# EAGLE design freebus-sniffer (EAGLE 4.16)
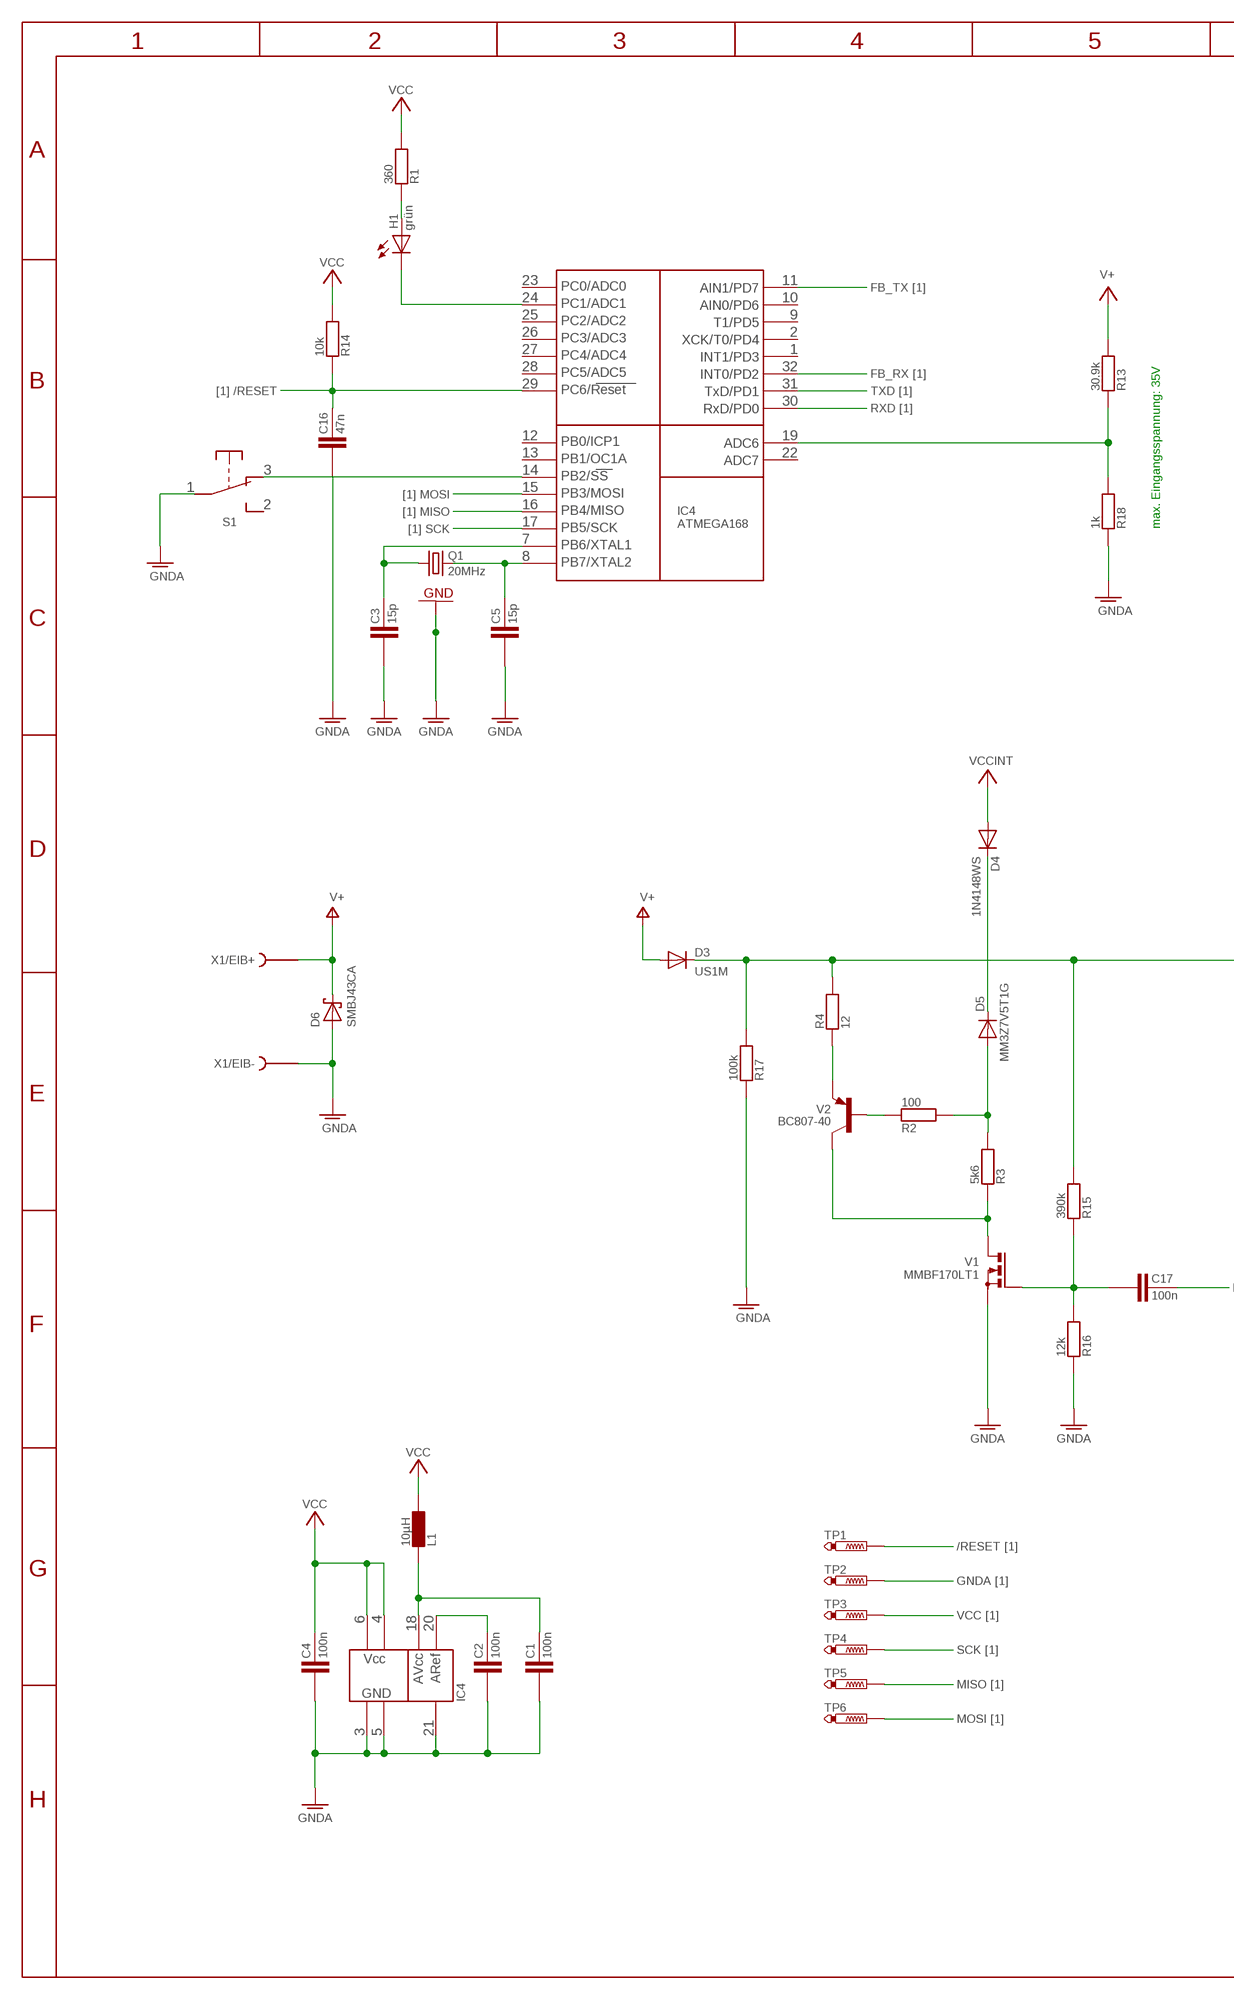
[diagram p0: schematic, sheet 1, part 1 of 2]
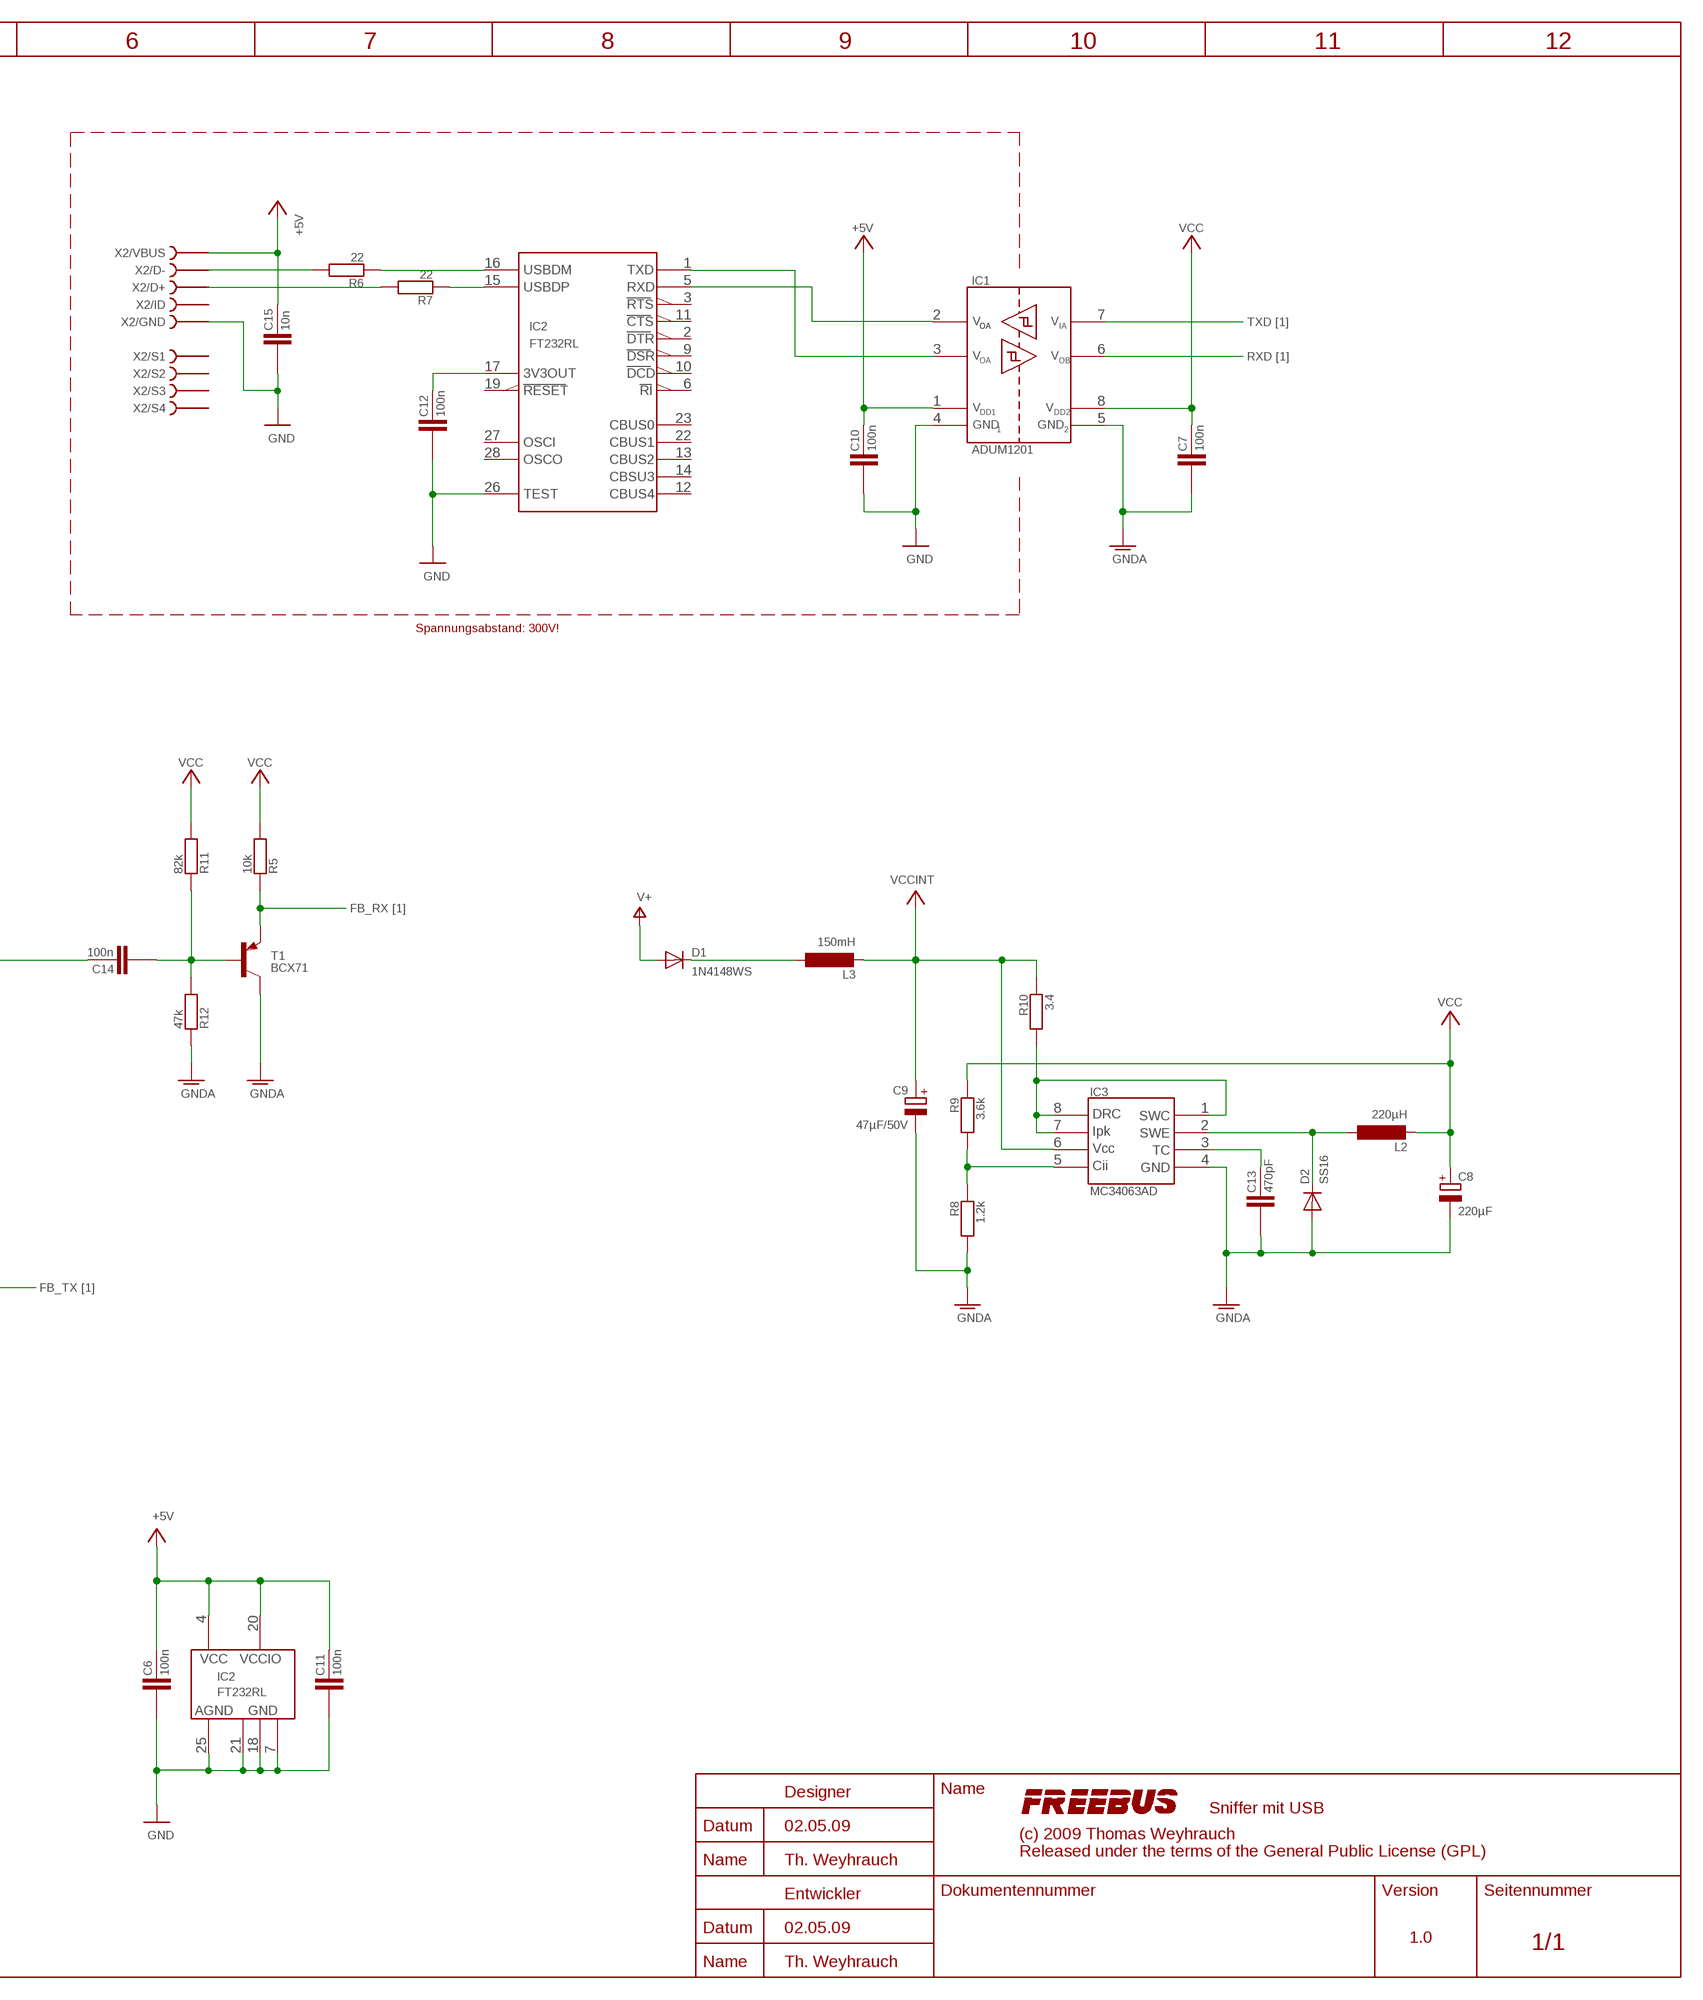
[diagram p1: schematic, sheet 1, part 2 of 2]

## Parts
C1  100n  C-0805  [0805]
C2  100n  C-0805  [0805]
C3  15p  C-0805  [0805]
C4  100n  C-0805  [0805]
C5  15p  C-0805  [0805]
C6  100n  C-0805  [0805]
C7  100n  C-0805  [0805]
C8  220µF  CPOL-EUE5-8.5  [E5-8,5]
C9  47µF/50V  CPOL-EUE5-6  [E5-6]
C10  100n  C-0805  [0805]
C11  100n  C-0805  [0805]
C12  100n  C-0805  [0805]
C13  470pF  C-0805  [0805]
C14  100n  C-0805  [0805]
C15  10n  C-0805  [0805]
C16  47n  C-0805  [0805]
C17  100n  C-0805  [0805]
D1  1N4148WS  DIODE-SOD323-R  [SOD323-R]
D2  SS16  DIODE-DO214AC  [DO214AC]
D3  US1M  DIODE-DO214AC  [DO214AC]
D4  1N4148WS  DIODE-SOD323-R  [SOD323-R]
D5  MM3Z7V5T1G  DIODE-SOD323-R  [SOD323-R]
D6  SMBJ43CA  SCHOTTKY-DIODESMD  [SMB]
H1  grün  LED3MM  [LED3MM]
IC1  ADUM1201  [SO8]
IC2  FT232RL  [SSOP28]
IC3  MC34063AD  [SO8]
IC4  ATMEGA168  ATMEGA8/48/88/168-AU  [TQFP32]
L1  10µH  L-0805  [0805]
L2  220µH  L-EU0207/2V  [0207/2V]
L3  150mH  L-EU0204/5  [0204/5]
Q1  20MHz  Q-NX3225SA  [Q_3.2X2.5]
R1  360  R-0805  [0805]
R2  100  R-0805  [0805]
R3  5k6  R-0805  [0805]
R4  12  R-EU_MELF0204W  [MINI_MELF-0204W]
R5  10k  R-0805  [0805]
R6  22  R-0805  [0805]
R7  22  R-0805  [0805]
R8  1.2k  R-0805  [0805]
R9  3.6k  R-0805  [0805]
R10  3.4  R-0805  [0805]
R11  82k  R-0805  [0805]
R12  47k  R-0805  [0805]
R13  30.9k  R-0805  [0805]
R14  10k  R-0805  [0805]
R15  390k  R-0805  [0805]
R16  12k  R-0805  [0805]
R17  100k  R-0805  [0805]
R18  1k  R-0805  [0805]
S1  SCHIEBESCHALTER_1XUM_90°  [SCHIEBESCHALTER-ABGEWINKELT]
T1  BCX71  BCX71SMD  [SOT23]
TP1  PTR1B1,27  [B1,27]
TP2  PTR1B1,27  [B1,27]
TP3  PTR1B1,27  [B1,27]
TP4  PTR1B1,27  [B1,27]
TP5  PTR1B1,27  [B1,27]
TP6  PTR1B1,27  [B1,27]
V1  MMBF170LT1  [SOT23]
V2  BC807-40  BC807-40SMD  [SOT23-BEC]
X1  EIB-BUSKLEMME  [EIB-BUSKLEMME]
X2  USB-MINI  [USB-M-S]

## Nets
3V3OUT: C12.1 IC2.17(A:3V3OUT)
+5V: C6.1 C10.1 C11.1 C15.1 IC1.1(VDD1) IC2.4(P:VCCIO) IC2.20(P:VCC) X2.VBUS
/RESET: C16.1 IC4.29(A:PC6) R14.1 TP1.PP(TP)
D+: R7.2 X2.D+
D-: R6.2 X2.D-
FB_RX: IC4.32(A:PD2) R5.1 T1.2(E)
FB_TX: C17.1 IC4.11(A:PD7)
GND: C6.2 C10.2 C11.2 C12.2 C15.2 IC1.4(GND1) IC2.7(P:GND) IC2.18(P:GND) IC2.21(P:GND) IC2.25(P:AGND) IC2.26(A:TEST) X2.GND
GNDA: C1.2 C2.2 C3.2 C4.2 C5.2 C7.2 C8.- C9.- C13.2 C16.2 D2.A D6.A IC1.5(GND2) IC3.4(GND) IC4.3(P:GND) IC4.5(P:GND) IC4.21(P:GND) Q1.2 Q1.4 R8.2 R12.1 R16.1 R17.1 R18.1 S1.1(P) T1.3(C) TP2.PP(TP) V1.2(S) X1.-
MISO: IC4.16(A:PB4) TP5.PP(TP)
MOSI: IC4.15(A:PB3) TP6.PP(TP)
N$1: C5.1 IC4.8(A:PB7) Q1.3
N$2: C3.1 IC4.7(A:PB6) Q1.1
N$3: IC1.3(VIB) IC2.1(A:TXD)
N$4: H1.A R1.1
N$5: H1.K(C) IC4.24(A:PC1)
N$8: IC2.16(A:USBDM) R6.1
N$9: IC2.15(A:USBDP) R7.1
N$10: IC4.14(A:PB2) S1.3(O)
N$11: D4.C D5.C
N$12: IC4.19(A:ADC6) R13.1 R18.2
N$13: C1.1 IC4.18(P:AVCC) L1.1
N$14: IC1.2(VOA) IC2.5(A:RXD)
N$15: C2.1 IC4.20(P:AREF)
N$17: D1.C L3.1
N$18: IC3.1(SWC) IC3.7(IPK) IC3.8(DRC) R10.2
N$19: C13.1 IC3.3(TC)
N$20: D2.C IC3.2(SWE) L2.1
N$21: IC3.5(CII) R8.1 R9.2
N$22: C14.2 R11.1 R12.2 T1.1(B)
N$24: R4.1 V2.E
N$25: R2.1 V2.B
N$26: D5.A R2.2 R3.2
N$27: R3.1 V1.3(D) V2.C
N$28: C14.1 D3.C R4.2 R15.2 R17.2
N$29: C17.2 R15.1 R16.2 V1.1(G)
RXD: IC1.6(VOB) IC4.30(A:PD0)
SCK: IC4.17(A:PB5) TP4.PP(TP)
TXD: IC1.7(VIA) IC4.31(A:PD1)
V+: D1.A D3.A D6.C R13.2 X1.+
VCC: C4.1 C7.1 C8.+ IC1.8(VDD2) IC4.4(P:VCC) IC4.6(P:VCC) L1.2 L2.2 R1.2 R5.2 R9.1 R11.2 R14.2 TP3.PP(TP)
VCCINT: C9.+ D4.A IC3.6(VCC) L3.2 R10.1
Unconnected: IC2.2(A:DTR) IC2.3(A:RTS) IC2.6(A:RI) IC2.8 IC2.9(A:DSR) IC2.10(A:DCD) IC2.11(A:CTS) IC2.12(A:CBUS4) IC2.13(A:CBUS2) IC2.14(A:CBUS3) IC2.19(A:RESET) IC2.22(A:CBUS1) IC2.23(A:CBUS0) IC2.24 IC2.27(A:OSCI) IC2.28(A:OSCO) IC4.1(A:PD3) IC4.2(A:PD4) IC4.9(A:PD5) IC4.10(A:PD6) IC4.12(A:PB0) IC4.13(A:PB1) IC4.22(A:ADC7) IC4.23(A:PC0) IC4.25(A:PC2) IC4.26(A:PC3) IC4.27(A:PC4) IC4.28(A:PC5) S1.2(S) X2.ID X2.SHIELD@1 X2.SHIELD@2 X2.SHIELD@3 X2.SHIELD@4

## Notes on the sheet
- FB_TX [1]
- TXD [1]
- RXD [1]
- FB_RX [1]
- [1] /RESET
- TXD [1]
- RXD [1]
- [1] MOSI
- [1] MISO
- [1] SCK
- max. Eingangsspannung: 35V
- Spannungsabstand: 300V!
- FB_RX [1]
- FB_TX [1]
- /RESET [1]
- GNDA [1]
- VCC [1]
- SCK [1]
- MISO [1]
- MOSI [1]
- Sniffer mit USB
- 02.05.09
- (c) 2009 Thomas Weyhrauch
- Released under the terms of the General Public License (GPL)
- Th. Weyhrauch
- 02.05.09
- 1.0
- Th. Weyhrauch

## Library data of the parts
C1-C7 C10-C17 = weyhrauch:C
C8 C9 = rcl:CPOL-EU: POLARIZED CAPACITOR, European symbol
D1-D5 = diode:DIODE-: DIODE
D6 = diode:SCHOTTKY-DIODE: Schottky Diode
H1 = led:LED: LED OSRAM: - CHIPLED LG R971, LG N971, LY N971, LG Q971, LY Q971, LO R971, LY R971 LH N974, LH R974 LS Q976, LO Q976, LY Q976 LO Q996 - Hyper CHIPLED LW Q18S LB Q993, LB Q99A, LB R99A - SideLED LS A670, LO A670, LY A670, LG A670, LP A670 LB A673, LV A673, LT A673, LW A673 LH A674 LY A675 LS A676, LA A676, LO A676, LY A676, LW A676 LS A679, LY A679, LG A679 - Hyper Micro SIDELED® LS Y876, LA Y876, LO Y876, LY Y876 LT Y87S - SmartLED LW L88C, LW L88S LB L89C, LB L89S, LG L890 LS L89K, LO L89K, LY L89K LS L896, LA L896, LO L896, LY L896 - TOPLED LS T670, LO T670, LY T670, LG T670, LP T670 LSG T670, LSP T670, LSY T670, LOP T670, LYG T670 LG T671, LOG T671, LSG T671 LB T673, LV T673, LT T673, LW T673 LH T674 LS T676, LA T676, LO T676, LY T676, LB T676, LH T676, LSB T676, LW T676 LB T67C, LV T67C, LT T67C, LS T67K, LO T67K, LY T67K, LW E67C LS E67B, LA E67B, LO E67B, LY E67B, LB E67C, LV E67C, LT E67C LW T67C LS T679, LY T679, LG T679 LS T770, LO T770, LY T770, LG T770, LP T770 LB T773, LV T773, LT T773, LW T773 LH T774 LS E675, LA E675, LY E675, LS T675 LS T776, LA T776, LO T776, LY T776, LB T776 LHGB T686 LT T68C, LB T68C - Hyper Mini TOPLED® LB M676 - Mini TOPLED Santana® LG M470 LS M47K, LO M47K, LY M47K Source: http://www.osram.convergy.de - LUMILED® LXK2-PW12-R00, LXK2-PW12-S00, LXK2-PW14-U00, LXK2-PW14-V00 LXK2-PM12-R00, LXK2-PM12-S00, LXK2-PM14-U00 LXK2-PE12-Q00, LXK2-PE12-R00, LXK2-PE12-S00, LXK2-PE14-T00, LXK2-PE14-U00 LXK2-PB12-K00, LXK2-PB12-L00, LXK2-PB12-M00, LXK2-PB14-N00, LXK2-PB14-P00, LXK2-PB14-Q00 LXK2-PR12-L00, LXK2-PR12-M00, LXK2-PR14-Q00, LXK2-PR14-R00 LXK2-PD12-Q00, LXK2-PD12-R00, LXK2-PD12-S00 LXK2-PH12-R00, LXK2-PH12-S00 LXK2-PL12-P00, LXK2-PL12-Q00, LXK2-PL12-R00 Source: www.luxeon.com
IC1 = weyhrauch:ADUM1201: Analog Devices Dual-Channel Digital Isolator 3V - 5V 0Mbps - 25Mbps
IC2 = weyhrauch:FT232RL
IC3 = weyhrauch:MC34063A: MC34063A ON Semiconductor (http://onsemi.com) 1.5 A, Step?Up/Down/ Inverting Switching Regulators
IC4 = weyhrauch:ATMEGA8/48/88/168-*: ATMEL ATMEGA8/48/88/168
L1 = weyhrauch:L
L2 L3 = rcl:L-EU: INDUCTOR, European symbol
Q1 = weyhrauch:Q-NX3225SA: SMD-Quarz NDK Crystal <http://www.ndk.com> Typ: NX3225SA Gehäuse: 3.2mm x 2.5mm Bezugsquelle: CSD-Electronics <http://www.csd-electronics.de>
R1-R3 R5-R18 = weyhrauch:R
R4 = rcl:R-EU_: RESISTOR, European symbol
S1 = weyhrauch:SCHIEBESCHALTER_1XUM_90°: Schiebeschalter, 90° abgewinkelt Hersteller: eao Serie: 1K2
T1 = transistor-pnp:BCX71SMD: PNP Transistor
TP1-TP6 = testpad:PTR1: TEST PIN
V1 = weyhrauch:MMBF170LT1: MMBF170LT1 ON Semiconductor SOT23; N-Channel-MOS-FET; 500mA, 50V, RDS(on) = 5Ohm
V2 = transistor-pnp:BC807*: PNP Transistror
X1 = Freebus:EIB-BUSKLEMME
X2 = weyhrauch:USB-MINI

## Net classes
1 power: width 0.406 mm

## Board
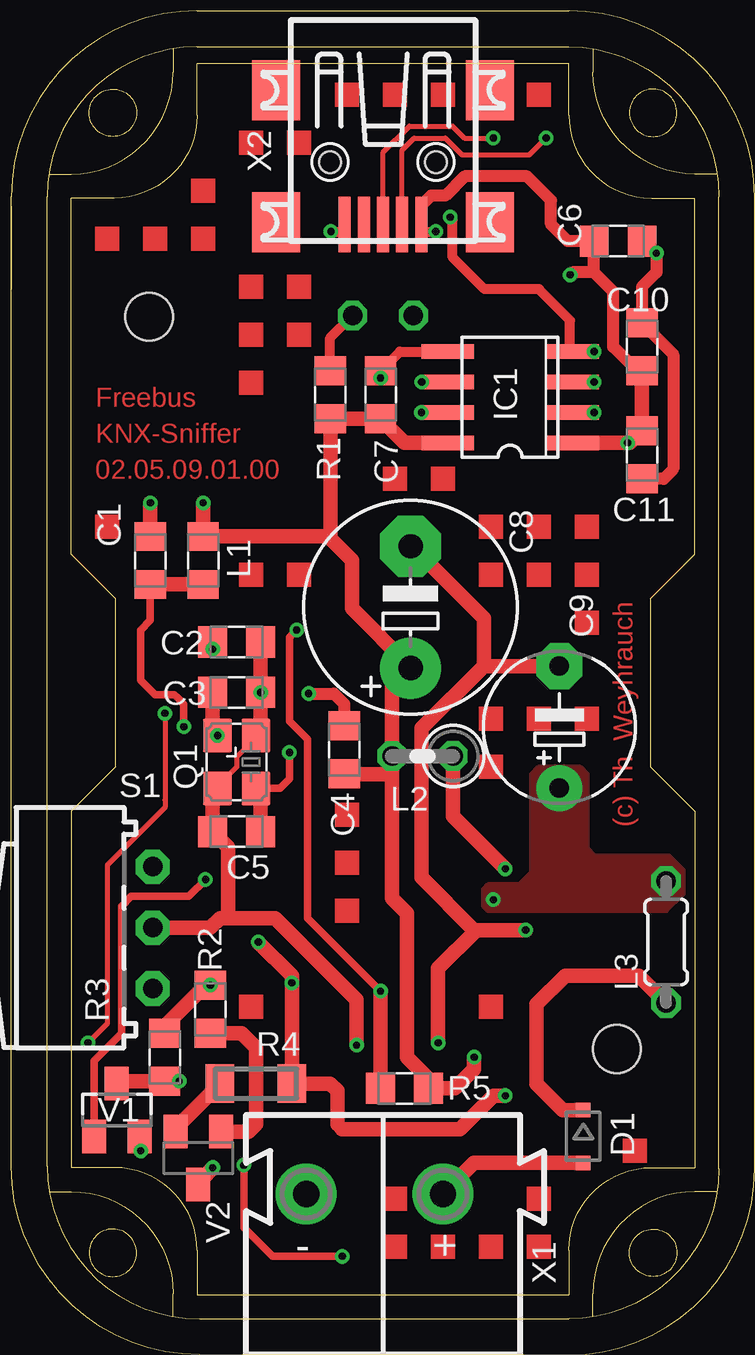
[diagram p2: board, top side]
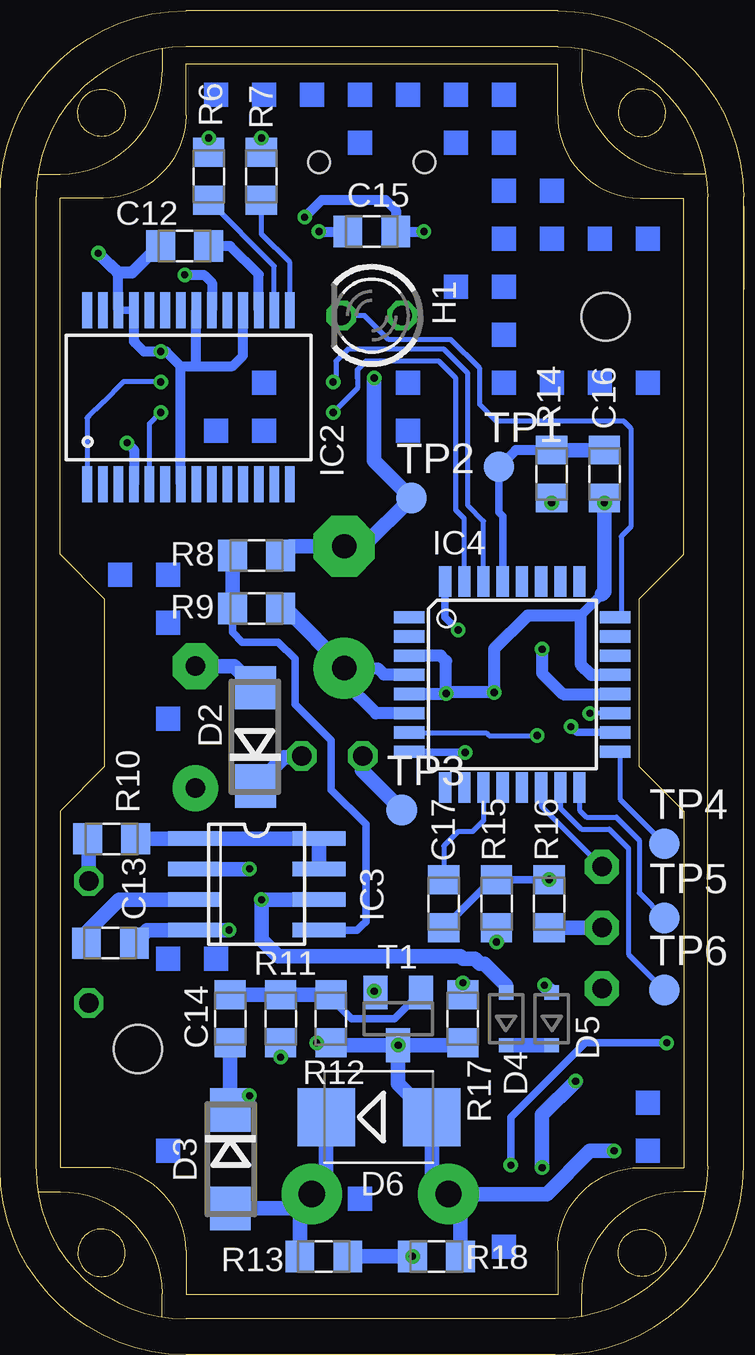
[diagram p3: board, bottom side, seen from below]

Size 26 x 51.3 mm. Coordinates in mm from the lower left corner, seen from the top.
Outline: 20.75,49.15 arc90 24.2,45.7
Outline: 20.75,49.15 20.75,51.3 5.25,51.3 5.25,49.15 arc-90 1.8,45.7 0,45.7 0,30.85 1.85,29 1.85,22 0,20.15 0,5.3 1.8,5.3
Outline: 20.75,49.15 arc90 24.2,45.7
Outline: 24.2,45.7 26,45.7 26,30.85 24.15,29 24.15,22 26,20.15 26,5.3 24.2,5.3 arc90 20.75,1.85 20.75,0 5.25,0 5.25,1.85
Outline: 5.25,1.85 arc90 1.8,5.3
Outline: 5.25,1.85 arc90 1.8,5.3
Copper layers (1*16): Top 0.035mm / dielectric 1.5mm / Bottom 0.035mm
Design rules "pcb-pool": minimum track width 6mil, minimum drill 0.3mm, track to track 6mil, track to pad 6mil, pad to pad 6mil, via to via 6mil, smd to smd 6mil, copper to edge 6mil, drill to drill 8mil, minimum pad ring 8mil, minimum via ring 6mil, stop-mask expansion 3mil, vias tented up to drill 0mil, thermal gap 8mil
Holes 2 mm at 3.25,40.75 22.75,10.25
tKeepout: area 7.2,8.3 to 26,20.3
tRestrict: area 20.7,8.2 to 24.8,12.3; area 1.2,38.8 to 5.2,42.8
bRestrict: area 20.7,8.2 to 24.8,12.3; area 1.2,38.8 to 5.2,42.8
Milling: 38 lines

### Footprints (pad centres in the part's own frame; a part is rotated, then mirrored left to right if it is on the bottom)
0805 = smd 1.3 x 1.2: 1 0.002,1; 2 0.002,-1
E5-8,5 = drill 1.016 pad 2.54 round: + -2.54,0 | drill 1.016 pad 2.54 octagon: - 2.54,0
E5-6 = drill 0.813 pad 1.905 round: + -2.54,0 | drill 0.813 pad 1.905 octagon: - 2.54,0
SOD323-R = smd 0.6 x 0.6: A 1.1,0; C -1.1,0
DO214AC = smd 1.8 x 1.7: A 2.05,0; C -2.05,0
SMB = smd 2.4 x 2.4: A 2.2,0; C -2.2,0
LED3MM = drill 0.813 octagon: A -1.27,0; K 1.27,0
SO8 = smd 0.6 x 2.2: 1 -1.905,-2.6; 2 -0.635,-2.6; 3 0.635,-2.6; 4 1.905,-2.6; 5 1.905,2.6; 6 0.635,2.6; 7 -0.635,2.6; 8 -1.905,2.6
SSOP28 = smd 0.4 x 1.5: 1 -4.225,-3.625; 2 -3.575,-3.625; 3 -2.925,-3.625; 4 -2.275,-3.625; 5 -1.625,-3.625; 6 -0.975,-3.625; 7 -0.325,-3.625; 8 0.325,-3.625; 9 0.975,-3.625; 10 1.625,-3.625; 11 2.275,-3.625; 12 2.925,-3.625; 13 3.575,-3.625; 14 4.225,-3.625; 15 4.225,3.625; 16 3.575,3.625; 17 2.925,3.625; 18 2.275,3.625; 19 1.625,3.625; 20 0.975,3.625; 21 0.325,3.625; 22 -0.325,3.625; 23 -0.975,3.625; 24 -1.625,3.625; 25 -2.275,3.625; 26 -2.925,3.625; 27 -3.575,3.625; 28 -4.225,3.625
TQFP32 = smd 1.27 x 0.508: 1 -4.293,2.8; 2 -4.293,2; 3 -4.293,1.2; 4 -4.293,0.4; 5 -4.293,-0.4; 6 -4.293,-1.2; 7 -4.293,-2; 8 -4.293,-2.8; 17 4.293,-2.8; 18 4.293,-2; 19 4.293,-1.2; 20 4.293,-0.4; 21 4.293,0.4; 22 4.293,1.2; 23 4.293,2; 24 4.293,2.8 | smd 0.508 x 1.27: 9 -2.8,-4.293; 10 -2,-4.293; 11 -1.2,-4.293; 12 -0.4,-4.293; 13 0.4,-4.293; 14 1.2,-4.293; 15 2,-4.293; 16 2.8,-4.293; 25 2.8,4.293; 26 2,4.293; 27 1.2,4.293; 28 0.4,4.293; 29 -0.4,4.293; 30 -1.2,4.293; 31 -2,4.293; 32 -2.8,4.293
0207/2V = drill 0.813 octagon: 1 -1.27,0; 2 1.27,0
0204/5 = drill 0.813 octagon: 1 -2.54,0; 2 2.54,0
Q_3.2X2.5 = smd 1.4 x 1.2: 1 -1.1,-0.8; 2 1.1,-0.8; 3 1.1,0.8; 4 -1.1,0.8
MINI_MELF-0204W = smd 1.2 x 1.6: 1 -1.5,0; 2 1.5,0
SCHIEBESCHALTER-ABGEWINKELT = drill 0.813 pad 1.422 octagon: 1 0,0; 2 0,-2.54; 3 0,2.54
SOT23 = smd 1 x 1.4: 1 -0.95,-1.1; 2 0.95,-1.1; 3 0,1.1
B1,27 = smd 1.27 x 1.27: PP 0,0
SOT23-BEC = smd 1 x 1.4: B -0.95,-1.1; C 0,1.1; E 0.95,-1.1
EIB-BUSKLEMME = drill 1.1 pad 2.54 round: + 8.2,6.7; - 2.5,6.7
USB-M-S = smd 2.3 x 0.5: D+ 2.6,0; D- 2.6,0.8; GND 2.6,-1.6; ID 2.6,-0.8; VBUS 2.6,1.6 | smd 2.5 x 2: SHIELD@1 -3,4.45; SHIELD@2 2.5,4.45; SHIELD@3 -3,-4.45; SHIELD@4 2.5,-4.45 | hole 0.9: 0,2.2; 0,-2.2

### Placement (x,y rotation side)
C1  3.3,30.6 180 top
C2  6.9,27.2 90 top
C3  6.9,25.1 90 top
C4  11.38,22.71 180 top
C5  6.9,19.3 270 top
C6  22.8,43.9 90 top
C7  12.9,37.5 180 top
C8  14.15,28.65 90 top
C9  20.35,23.65 90 top
C10  23.8,39.5 180 top
C11  23.8,35 0 top
C12  20.8,43.7 270 bottom
C13  23.9,14.65 90 bottom
C14  18.9,11.5 180 bottom
C15  13,44.3 90 bottom
C16  3.3,34.2 0 bottom
C17  10,16.3 0 bottom
D1  21.35,6.6 270 top
D2  17.85,23.25 90 bottom
D3  18.9,5.65 270 bottom
D4  7.4,11.5 90 bottom
D5  5.5,11.5 90 bottom
D6  12.7,7.4 0 bottom
H1  13,40.8 180 bottom
IC1  18.3,37.4 90 top
IC2  20.64,37.39 0 bottom
IC3  17.8,17.1 270 bottom
IC4  7.14,25.43 0 bottom
L1  5.5,30.6 180 top
L2  14.65,22.45 180 top
L3  24.8,14.7 90 top
Q1  6.9,22.2 270 top
R1  10.8,37.5 0 top
R2  5.8,11.9 180 top
R3  3.9,9.9 180 top
R4  7.7,8.8 0 top
R5  13.9,8.6 90 top
R6  19.8,46.6 180 bottom
R7  17.6,46.6 180 bottom
R8  17.8,30.8 90 bottom
R9  17.8,28.6 270 bottom
R10  23.85,19 90 bottom
R11  16.8,11.5 0 bottom
R12  14.7,11.5 180 bottom
R13  15,1.6 270 bottom
R14  5.5,34.2 0 bottom
R15  7.8,16.3 0 bottom
R16  5.6,16.3 180 bottom
R17  9.2,11.5 180 bottom
R18  10.3,1.6 270 bottom
S1  3.4,15.3 0 top
T1  11.9,11.5 180 bottom
TP1  7.7,34.5 0 bottom
TP2  11.35,33.2 0 bottom
TP3  11.75,20.2 0 bottom
TP4  0.8,18.8 0 bottom
TP5  0.8,15.7 0 bottom
TP6  0.8,12.7 0 bottom
V1  1.9,7.7 0 top
V2  5.3,5.7 180 top
X1  7.3,-2.5 0 top
X2  13,47.2 270 top

### Tracks (layer width: path | path; a pad name or v marks a point on that pad's centre or on a via)
3V3OUT
  Bottom 0.406: IC2.17 17.71,42.52 18.9,43.7 19.3,43.7 C12.1
+5V  (via drill 0.3)
  Top 0.406: C10.1 23.6,38.5 | C11.1 23.7,36 v23.2,35.5 | X2.VBUS 14.6,44.3 v15.2,44.3 | C6.1 | 20.9,42.6 v20.8,42.5
  Top 0.508: 23.6,38.5 22.6,39.5 22.6,41.8 21.8,42.6 | 21.8,42.6 C6.1 20.7,43.9 20,44.6 20,45.6 19,46.6 16.4,46.6 15.6,45.8 15,45.8 14.6,45.4 X2.VBUS | 21.8,42.6 20.9,42.6
  Top 0.61: C10.1 C11.1 23.3,35.49 IC1.1
  Bottom 0.406: IC2.4 22.91,35.22 v23.2,35.5 | v15.2,44.3 C15.1 | IC2.20 19.66,42.16 20,42.5 v20.8,42.5
/RESET
  Bottom 0.305: IC4.29 7.54,32.44 7.7,32.6 TP1.PP
  Bottom 0.406: R14.1 7,35.2 TP1.PP
  Bottom 0.61: C16.1 R14.1
D+  (via drill 0.3)
  Top 0.203: X2.D+ 13,47.6 14.1,48.7 15.9,48.7 16.4,48.2 v17.6,48.2
  Bottom 0.203: R7.2 v17.6,48.2 17.5,47.6
D-  (via drill 0.3)
  Top 0.203: X2.D- 13.8,47.7 14.3,48.2 15.6,48.2 16.3,47.5 19.1,47.5 v19.8,48.2
  Bottom 0.203: R6.2 v19.8,48.2
FB_RX  (via drill 0.3)
  Top 0.305: v12.9,12.65 9.85,15.7 9.85,23.15 9.6,23.4 | 9.6,23.4 9.15,23.85 | v9.4,27.7 9.1,27.4 9.1,23.9 9.6,23.4
  Top 0.61: v12.9,12.65 R5.1
  Bottom 0.305: IC4.32 9.94,28.24 v9.4,27.7
  Bottom 0.61: T1.2 12.9,12.6 v12.9,12.65
FB_TX
  Bottom 0.203: IC4.11 8.34,19.76 8.8,19.3 9.4,19.3 9.7,19 | 9.7,19 9.95,18.75 | C17.1 10,18.7 9.7,19
GND  (via drill 0.3)
  Top 0.406: C10.2 | C6.2 v24.4,43.4 | v21.8,39.3 IC1.4 20.8,39.3 20.8,40.6 19.5,41.9 17.23,41.9 15.9,43.23 15.9,44.8 v15.8,44.9 | v10.83,44.3 11.3,44.3 11.4,44.4 X2.GND
  Top 0.508: C11.2 24.7,34 25.1,34.4 25.1,39.2 C10.2 | C10.2 23.8,42 24.4,42.6 v24.4,43.4
  Bottom 0.305: IC2.25 IC2.26
  Bottom 0.406: 23.9,42.9 23.8,42.8 | IC2.26 23.56,42.56 23.6,42.6 | IC2.18 18.37,39.13 18.8,38.7 20.32,38.7 | v21.8,39.3 22.5,39.3 22.8,39.6 | 22.8,39.6 22.9,39.7 | IC2.25 22.91,39.72 22.8,39.6 | v10.83,44.3 11.9,44.3 C15.2 12,45.2 12.43,45.63 15.07,45.63 v15.8,44.9 | 21.9,43.7 C12.2 | 20.32,38.7 IC2.21 | v21.8,39.3 21.59,39.3 | IC2.7 | IC2.7 | 20.97,38.7 20.32,38.7 | IC2.7 20.97,38.7 | 20.97,38.7 21.57,39.3 v21.8,39.3
  Bottom 0.508: v24.4,43.4 23.9,42.9 23.6,42.6 23,42.6 21.9,43.7
GNDA  (via drill 0.3)
  Top 0.203: Q1.2 6.1,21.2 6.9,22 6.9,22.4 7.7,23.2 Q1.4
  Top 0.305: v12.9,38.2 C7.2
  Top 0.406: IC1.5 13.7,39.3 C7.2 | IC1.5
  Top 0.508: v9.9,25.05 10.95,25.05 11.38,24.62 C4.2
  Top 0.61: 16.9,15.2 16.8,15.2 14.6,17.4 14.6,23.6 17.2,26.2 | 16.9,15.2 v18.95,15.2 | V1.2 2.85,6.05 v2.9,6 | 6.55,15.7 8.5,15.7 11.9,12.3 T1.3 | 6.55,15.7 6.2,15.7 5.8,15.3 S1.1 | 7.9,23.5 Q1.4 7.65,23.3 7.9,23.55 C3.2 C2.2 | 6.55,15.7 6.55,18.65 C5.2 5.9,20.9 Q1.2 | C9.- 17.2,26.2 | 17.2,26.2 17.2,28.2 14.21,31.19 C8.- | C8.- | C1.2 v3.3,33 | v15.3,10.5 15.3,13.6 16.9,15.2
  Bottom 0.305: v9.9,25.05 9.92,25.03
  Bottom 0.406: 3.4,29.2 4.3,28.3
  Bottom 0.508: 9.92,25.03 IC4.5 | IC4.3 10.13,26.63 9.9,26.4 9.9,25.1 | 9.9,25.1 v9.9,25.05 | 9.9,25.1 C3.2 7.9,26.9 6.5,28.3 4.3,28.3 4.3,26.28 3.85,25.83 2.65,25.83 IC4.21
  Bottom 0.61: C13.2 22.36,15.2 IC3.4 v18.95,15.2 | v15.3,10.5 R12.1 14.6,10.4 T1.3 | D6.A 10.5,7.5 | X1.- 10.5,4.9 D6.A | D6.A 11.9,8.8 T1.3 | R17.1 9.3,10.4 T1.3 | v2.9,6 3.9,6 5.7,4.2 X1.- | S1.1 R16.1 | R18.1 9.3,3.7 X1.- | R8.2 16.41,31.19 C8.- 13.36,31.19 TP2.PP 12.9,34.75 v12.9,38.2 | C9.- 18.75,26.2 D2.A | C16.2 v3.3,33 3.3,29.3 3.4,29.2
  other vias: 11.9,10.4 7.9,25.1
MISO
  Bottom 0.203: TP5.PP 1.85,16.75 1.85,18.95 2.8,19.9 4.05,19.9 4.34,20.19 IC4.16
MOSI
  Bottom 0.203: 2.3,18.45 2.3,18.6 3.1,19.4 4.26,19.4 5.14,20.28 IC4.15 | 2.3,18.45 2.3,18.3 | TP6.PP 2.3,14.2 2.3,18.45
N$1  (via drill 0.3)
  Top 0.305: Q1.3 8.7,21.1 9.1,21.5 v9.1,22.6
  Top 0.61: Q1.3 7.9,20.9 C5.1
  Bottom 0.305: IC4.8 11.25,22.61 11.25,22.6 v9.1,22.6
N$2  (via drill 0.3)
  Top 0.305: Q1.1 6.1,23.5
  Top 0.61: C3.1 5.9,23.5 Q1.1
  Bottom 0.203: Q1.1 8.11,23.3 8.22,23.42 11.43,23.42 IC4.7
  other vias: 6.1,23.3
N$3  (via drill 0.3)
  Top 0.203: IC1.3 21.9,38.03 v21.8,38.03
  Bottom 0.203: v21.8,38.03 23.37,38.03 24.2,37.2 | 24.2,37.2 24.8,36.6 | IC2.1 24.87,36.53 24.2,37.2
N$4
  Top 0.406: R1.1 10.8,39.87 H1.A
N$5
  Bottom 0.203: H1.K 13.3,40.8 12.3,39.8 9.7,39.8 8.5,38.6 8.5,37.1 7.8,36.4 2.5,36.4 2.2,36.1 2.2,32 2.6,31.6 2.6,28.28 IC4.24
N$8
  Bottom 0.203: IC2.16 17.07,42.86 R6.1
  Bottom 0.61: R6.1
N$9
  Bottom 0.203: IC2.15 16.41,43.02 17.6,44.2 R7.1
N$10
  Bottom 0.203: IC4.14 5.94,21.16 | IC4.14 | S1.3 5.94,20.38 IC4.14
N$11
  Bottom 0.61: D4.C D5.C
N$12  (via drill 0.3)
  Top 0.203: v0.7,10.5 1.5,11.3 1.5,17.9 3.91,20.31 3.91,20.62 v3.91,24.23
  Top 0.305: R18.2 8.4,1.6 7.2,2.8 v7.2,5.4
  Bottom 0.203: IC4.19 v3.91,24.23
  Bottom 0.305: R18.2 12.6,1.6 R18.2 | v7.2,5.4 7.2,7.4 4.1,10.5 v0.7,10.5
  Bottom 0.61: R18.2 R13.1
  other vias: 11.3,1.6
N$13  (via drill 0.3)
  Top 0.305: 4.39,24.91 4.3,25 3.5,25 2.9,25.6 2.9,27.7 3.3,28.1 C1.1 | 4.39,24.91 4.6,24.7 | 4.39,24.91 4.39,24.92 4.69,24.61 v4.69,23.67
  Top 0.61: L1.1 C1.1
  Bottom 0.305: IC4.18 4.45,23.43 v4.69,23.67
N$14  (via drill 0.3)
  Top 0.203: v21.8,36.77 IC1.2
  Bottom 0.203: IC2.5 22.26,36.3 v21.8,36.77
N$15  (via drill 0.3)
  Top 0.508: C2.1 v5.9,26.9
  Bottom 0.508: IC4.20 5.03,25.03 5.9,25.9 v5.9,26.9
N$17
  Top 0.61: D1.C 20.5,7.7 19.4,8.8 19.4,12.1 20.6,13.3 23.66,13.3 L3.1
N$18
  Bottom 0.61: 20.35,19 R10.2 | 20.35,19 20.34,19 IC3.8 | IC3.8 | IC3.8 IC3.7 | IC3.8 | 20.35,19 20.36,19 IC3.1
N$19
  Bottom 0.61: IC3.3 23.54,16.46 24.95,15.05 24.95,14.65 C13.1
N$20  (via drill 0.3)
  Top 0.61: L2.1 15.91,19.94 v18.1,17.75 | L2.1
  Bottom 0.61: IC3.2 18.12,17.73 v18.1,17.75 | L2.1 15.9,22.43 15.9,22.4 16.65,22.4 D2.C
N$21
  Bottom 0.305: 13.4,15.4 13.25,15.55 13.25,19.6 14.7,21.05 14.7,21.6 14.7,23.1 16.2,24.6 16.2,26.5 16.9,27.2 18.4,27.2 18.8,27.6 R9.2 | 13.4,15.4 13.45,15.35 | IC3.5 13.61,15.2 13.4,15.4
  Bottom 0.61: R9.2 R8.1
N$22
  Bottom 0.305: T1.1 12.05,11.5 13.85,11.5 14.7,12.35 R12.2
  Bottom 0.61: R11.1 R12.2 C14.2
N$24
  Top 0.61: V2.E 4.35,6.95 R4.1
N$25
  Top 0.61: V2.B 7.4,6.8 7.7,7.1 7.7,10.3 7.1,10.9 R2.1
N$26  (via drill 0.3)
  Top 0.305: R2.2
  Top 0.61: R2.2 | R2.2 5.7,13 3.9,11.2 R3.2
  Bottom 0.61: R2.2 D5.A
  other vias: 5.8,12.9
N$27  (via drill 0.3)
  Top 0.61: v5.9,5.3 V2.C | R3.1 v4.5,8.9 | R3.1 | V1.3 2,8.9 R3.1
  Bottom 0.61: v5.9,5.3 5.9,7.5 v4.5,8.9
N$28  (via drill 0.3)
  Top 0.61: v18.1,8.3 17.6,8.3 16.2,6.9 11.3,6.9 11.1,7.1 11.1,8.5 10.8,8.8 R4.2 9.2,8.9 v9.2,13 9.2,13.3 v7.8,14.7
  Bottom 0.61: C14.1 18.9,8.3 v18.1,8.3 D3.C | R17.2 v9.2,13 | R15.2 7.8,15.2 v7.8,14.7
N$29  (via drill 0.3)
  Top 0.305: V1.1 0.95,9.75 2.1,10.9 2.1,16.2 2.5,16.6 4.9,16.6 R16.2
  Bottom 0.305: R16.2 | C17.2 8,17.3 R15.1 | R15.1 | R15.1 5.65,17.3
  Bottom 0.61: R16.2 5.65,17.3
  other vias: 5.6,17.3
RXD  (via drill 0.3)
  Top 0.305: v14.61,38.03 IC1.6 | v14.61,38.03
  Bottom 0.203: IC4.30 8.34,32.24 9,32.9 9,38.4 10,39.4 14,39.4 14.5,38.9 14.5,38.15 v14.61,38.03
SCK
  Bottom 0.203: 2.65,22.63 2.65,22.65 | 2.65,22.63 IC4.17 2.65,22.63 2.65,22.25 | 2.65,22.63 2.65,22.25 | 2.65,22.25 2.65,22.05 | TP4.PP 2.65,20.65 2.65,22.25
TXD  (via drill 0.3)
  Top 0.203: IC1.7 | v14.6,36.77 IC1.7
  Bottom 0.203: IC4.31 9.14,32.34 9.5,32.7 9.5,38.2 10.2,38.9 13.25,38.9 13.6,38.55 13.6,38.2 | v14.6,36.77 13.6,37.77 13.6,38.2 | 13.6,38.2 13.6,38.54
V+
  Top 0.61: D1.A 16.8,5.5 X1.+
  Bottom 0.61: X1.+ 15.55,4.2 14.9,4.85 D6.C | D3.A 16.1,3.6 X1.+ | R13.2 16,3.7 X1.+
VCC  (via drill 0.3)
  Top 0.406: C7.1
  Top 0.508: C8.+ 14.15,26.15
  Top 0.61: v16.8,9.9 16.8,9.4 16,8.6 R5.2 14.9,9 14,9.9 14,15.9 13.7,16.2 | 13.88,25.83 C8.+ 14.11,26.11 13.38,25.38 L2.2 13.38,21.7 | 13.38,21.7 13.38,16.52 13.7,16.2 | 13.7,16.2 13.9,16 | 8.27,31.6 L1.2 5.5,32.9 v5.5,33 | 8.27,31.6 10.7,31.6 11.7,30.6 11.7,30 | 11.7,30 11.7,29.3 | 14.15,26.15 11.7,28.6 11.7,30 | C4.1 11.4,21.7 13.38,21.7 | 8.27,31.6 10.8,31.6 R1.2 C7.1 13.9,35.49 IC1.8
  Bottom 0.406: 14.15,25.55 C8.+ | 11.25,25.85 IC4.4 | 16.9,28.5 R9.1
  Bottom 0.508: IC4.6 12.83,24.23 14.15,25.55 | 11.25,25.85 12.5,25.85 12.75,26.1 C8.+ | 17,28.5 16.9,28.5 16.5,28.5
  Bottom 0.61: R11.2 v16.8,9.9 | C8.+ 14.15,26.15 16.5,28.5 | R14.2 v5.5,33 | L2.2 13.4,22.45 13.4,21.85 TP3.PP
VCCINT  (via drill 0.3)
  Top 0.61: L3.2 24.8,17.2 | v17.6,16.46 v17.61,16.46
  Bottom 0.61: IC3.6 v17.6,16.46 17.6,14.8 16.9,14.1 9.3,14.1 9.2,14 8.7,14 8.5,13.8 8.3,13.8 7.4,12.9 D4.A | 24.8,17.2 L3.2 24.8,18.95 R10.1
  pour Top (no thermals): 19.5,22 21.2,22 21.5,21.7 21.5,18.6 21.8,18.3 24.9,18.3 25.5,17.7 25.5,16.7 24.8,16 17.4,16 17.2,16.2 17.2,16.9 17.4,17.1 18.7,17.1 19.2,17.6 19.2,21.7
(copper drawn outside any net)
  shapes: Bottom area x39, Top area x43

### Text on the board
Top: Freebus | KNX-Sniffer | 02.05.09.01.00 | (c) Th. Weyhrauch
Drill_legend: Bohrlegende | 2.0000 mm / 78.740 mil | 1.1000 mm / 43.307 mil | 1.0160 mm / 40.000 mil | 0.9000 mm / 35.433 mil | 0.8128 mm / 32.000 mil | 0.3000 mm / 11.811 mil